# Altium schematic sheet 1-Power.SCHDOC
size A4
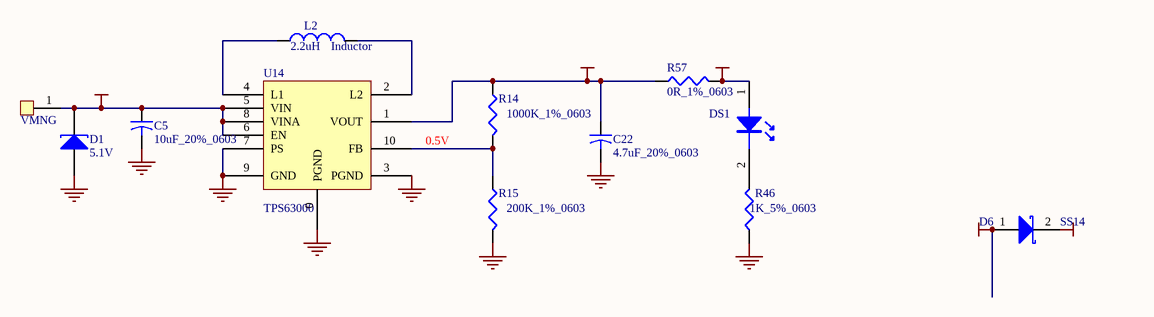
[diagram p0: 1-Power.SCHDOC]

## Parts
C5  10uF_20%_0603  [C1608-0603]
C22  4.7uF_20%_0603  [C1608-0603]
D1  5.1V  [LED0805]
D6  SS14  [LED0805]
DS1  LED  [LED0805]  (value not drawn)
L2  Inductor  value 2.2uH  [L3x3x1.5_5A]
R14  1000K_1%_0603  [C1608-0603]
R15  200K_1%_0603  [C1608-0603]
R46  1K_5%_0603  [C1608-0603]
R57  0R_1%_0603  [C1608-0603]
U14  TPS63000  [QFN-10]
VMNG  ND  [END_3_6]  (value not drawn)

## Nets
GND: C5.2 C22.2 D1.1(A) R15.2 R46.1 U14.0(PGND) U14.3(PGND) U14.7(PS) U14.9(GND)
VCC_2V8: D6.1(A) DS1.1 R57.2
VCC_MNG: C5.1 D1.2(K) U14.5(VIN) U14.6(EN) U14.8(VINA) VMNG.1(SW)
VCC_OUT: C22.1 R14.1 R57.1 U14.1(VOUT)
VCC_TH: D6.2(K)
NetDS1_2: DS1.2 R46.2
NetL2_1: L2.1 U14.4(L1)
NetL2_2: L2.2 U14.2(L2)
NetR14_2: R14.2 R15.1 U14.10(FB)

## Notes on the sheet
- 0.5V

## Library data of the parts
C5 C22 = Cap2: Capacitor; Value: 0.1uF 20% 0603; Published: 23-Sep-2002; Publisher: Altium Limited
D1 = D Tunnel1: Tunnel Diode - RLC Model; Published: 8-Jun-2000; LatestRevisionDate: 17-Jul-2002; LatestRevisionNote: Re-released for DXP Platform.; Publisher: Altium Limited
D6 = D Schottky: Schottky Diode; Code - JEDEC: DO-214-AA; Published: 8-Jun-2000; Revision: July-2002: Re-released for DXP Platform.; Publisher: Altium Limited
R14 R15 R57 = Res3: Resistor; Value: 1K%5 0603; Published: 8-Jun-2000; Revision: July-2002: Re-released for DXP Platform.; Publisher: Altium Limited
R46 = Res3: Resistor; Value: 1K; Published: 8-Jun-2000; Revision: July-2002: Re-released for DXP Platform.; Publisher: Altium Limited
L2 = Inductor: Published: 8-Jun-2000; Revision: July-2002: Re-released for DXP Platform.; Publisher: Altium Limited